# Altium project encoder-circuit.PrjPcb
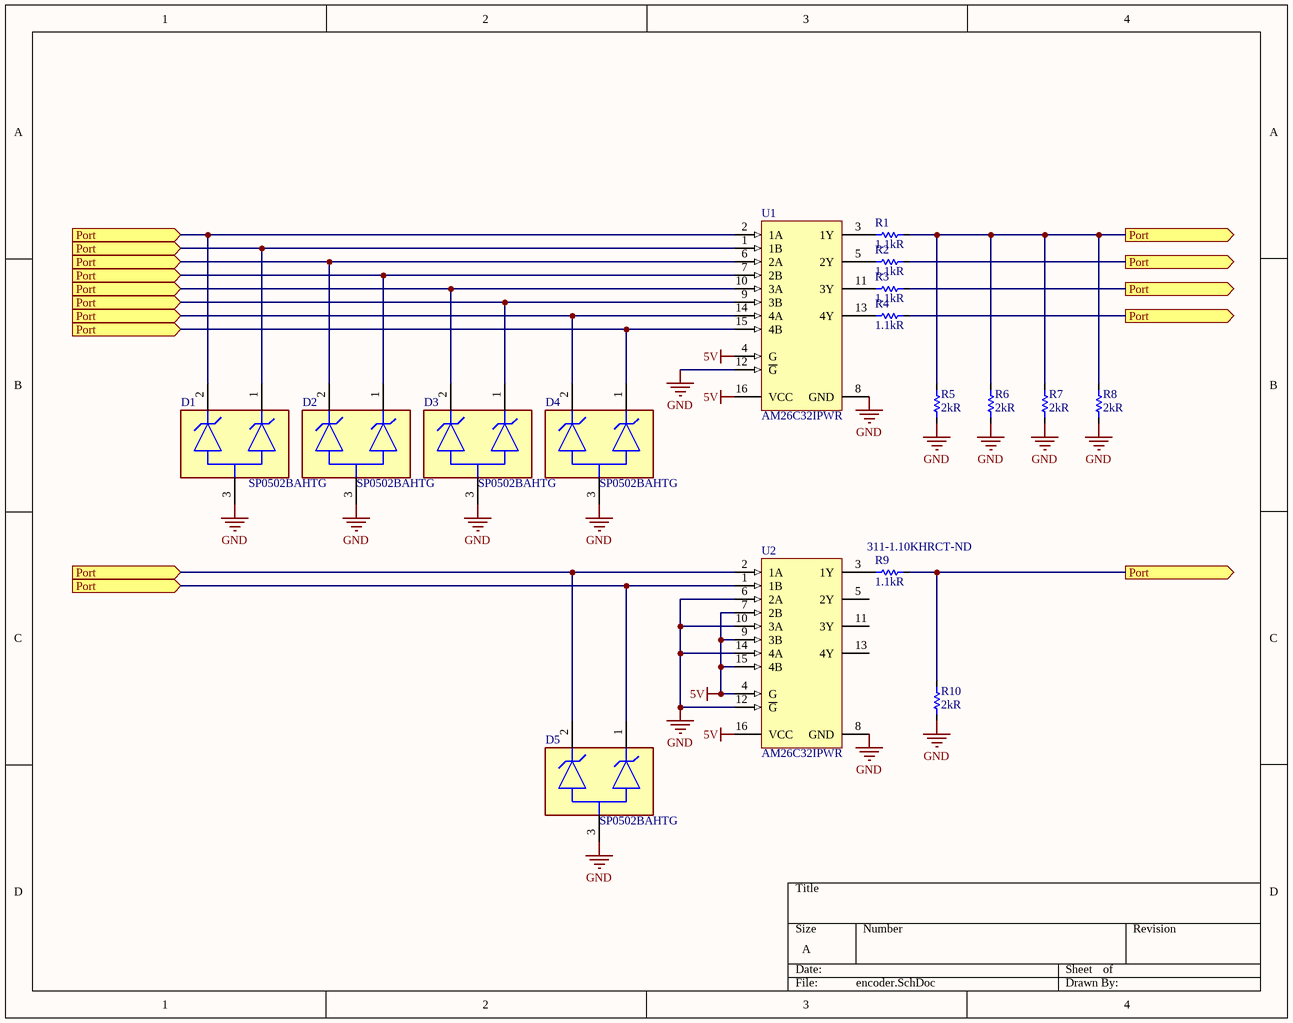
[diagram p0: encoder.SchDoc]
1 sheet, 17 parts. Net scope: flat (ports and power ports of the same name join across sheets).
Board file: encoder.PcbDoc

## Sheet encoder.SchDoc
size A

### Parts
D1  SP0502BAHTG  [FP-SP0502BAH-MFG]
D2  SP0502BAHTG  [FP-SP0502BAH-MFG]
D3  SP0502BAHTG  [FP-SP0502BAH-MFG]
D4  SP0502BAHTG  [FP-SP0502BAH-MFG]
D5  SP0502BAHTG  [FP-SP0502BAH-MFG]
R1  1.1kR  [RESC1005N]
R2  1.1kR  [RESC1005N]
R3  1.1kR  [RESC1005N]
R4  1.1kR  [RESC1005N]
R5  2kR  [RESC1005N]
R6  2kR  [RESC1005N]
R7  2kR  [RESC1005N]
R8  2kR  [RESC1005N]
R9  1.1kR  Supplier Part Number 1: 311-1.10KHRCT-ND  [RESC1005N]
R10  2kR  [RESC1005N]
U1  AM26C32IPWR  [PW0016A_L]
U2  AM26C32IPWR  [PW0016A_L]

### Ports
Port (in), Port (out)

### Nets
5V: U1.4(G) U1.16(VCC) U2.4(G) U2.7(2B) U2.9(3B) U2.15(4B) U2.16(VCC)
GND: D1.3(COMMON_ANODE) D2.3(COMMON_ANODE) D3.3(COMMON_ANODE) D4.3(COMMON_ANODE) D5.3(COMMON_ANODE) R5.2 R6.2 R7.2 R8.2 R10.2 U1.8(GND) U1.12(~{G}) U2.6(2A) U2.8(GND) U2.10(3A) U2.12(~{G}) U2.14(4A)
NetD1_1: D1.1(1_CATHODE) D1.2(2_CATHODE) D2.1(1_CATHODE) D2.2(2_CATHODE) D3.1(1_CATHODE) D3.2(2_CATHODE) D4.1(1_CATHODE) D4.2(2_CATHODE) D5.1(1_CATHODE) D5.2(2_CATHODE) R1.2 R2.2 R3.2 R4.2 R5.1 R6.1 R7.1 R8.1 R9.2 R10.1 U1.1(1B) U1.2(1A) U1.6(2A) U1.7(2B) U1.9(3B) U1.10(3A) U1.14(4A) U1.15(4B) U2.1(1B) U2.2(1A) ; port Port
NetR1_1: R1.1 U1.3(1Y)
NetR2_1: R2.1 U1.5(2Y)
NetR3_1: R3.1 U1.11(3Y)
NetR4_1: R4.1 U1.13(4Y)
NetR9_1: R9.1 U2.3(1Y)

Not connected (* = marked no-connect by the designer): U2 5(2Y) 11(3Y) 13(4Y)

### Library data of the parts
D1-D5 = CMP-08607-000028-1: TVS DIODE 5.5V 8.5V SOT23-3; Manufacturer: Littelfuse Inc; Description: 8.5V Clamp Ipp Tvs Diode Surface Mount SOT-23-3; Value: 30pF; Standoff Height: 0.01mm; Number Of Channels: 2; Direction: Unidirectional; Lead Free: Yes; Device Class L1: Circuit Protection; Temperature Range High: +125°C; Package: SP0502BAH; Reverse Standoff Voltage: 5.5V; Device Class L3: unset; Clamping Voltage: 8.5V; RoHS: TRUE; Capacitance: 30pF; Octopart: https://octopart.com/sp0502bahtg-littelfuse-66370; Temperature: -40°C to +125°C; Category: Diode; Manufacturer Part Number: SP0502BAHTG; ComponentLink2URL: https://www.littelfuse.com/~/media/electronics/datasheets/tvs_diode_arrays/littelfuse_tvs_diode_array_sp05_datasheet.pdf.pdf; Digikey Description: TVS DIODE 5.5V 8.5V SOT23-3; Mouser Description: TVS Diodes / ESD Suppressors 2 Channel SMT array; Height: 1.12mm; Automotive: No; Temperature Range Low: -40°C; Device Class L2: TVS Diodes; ComponentLink2Description: Datasheet
R1-R4 R9 = Resistor: RES SMD 1.1K OHM 1% 1/10W 0603; Manufacturer: Yageo; Manufacturer Part Number: RC0603FR-071K1L; Power Rating: 100mW; Temperature Coefficient: 100ppm/°C; Voltage Rating (DC): 50V; ComponentLink1URL: https://www.seielect.com/catalog/SEI-Packaging.pdf?src-supplier=Verical; ComponentLink1Description: https://www.seielect.com/catalog/SEI-Packaging.pdf?src-supplier=Verical; ComponentLink2URL: https://www.seielect.com/catalog/sei-rmcf_rmcp.pdf?src-supplier=Digi-Key; ComponentLink2Description: https://www.seielect.com/catalog/sei-rmcf_rmcp.pdf?src-supplier=Digi-Key; ComponentLink3URL: https://www.seielect.com/catalog/SEI-Packaging.pdf?src-supplier=Avnet; ComponentLink3Description: https://www.seielect.com/catalog/SEI-Packaging.pdf?src-supplier=Avnet; ComponentLink4URL: https://www.seielect.com/catalog/SEI-RMCF_RMCP.pdf?src-supplier=Avnet+Asia; ComponentLink4Description: https://www.seielect.com/catalog/SEI-RMCF_RMCP.pdf?src-supplier=Avnet+Asia; ComponentLink5URL: https://www.seielect.com/catalog/SEI-RMCF_RMCP.pdf?src-supplier=Avnet; ComponentLink5Description: https://www.seielect.com/catalog/SEI-RMCF_RMCP.pdf?src-supplier=Avnet; ComponentLink6URL: http://www.seielect.com/Catalog/SEI-rmc.pdf?src-supplier=Future+Electronics; ComponentLink6Description: http://www.seielect.com/Catalog/SEI-rmc.pdf?src-supplier=Future+Electronics; ComponentLink7URL: https://www.seielect.com/catalog/SEI-Packaging.pdf?src-supplier=Arrow+Electronics; ComponentLink7Description: https://www.seielect.com/catalog/SEI-Packaging.pdf?src-supplier=Arrow+Electronics; ComponentLink8URL: https://www.seielect.com/catalog/SEI-Packaging.pdf?src-supplier=Quest; ComponentLink8Description: https://www.seielect.com/catalog/SEI-Packaging.pdf?src-supplier=Quest; Supplier 1: Digi-Key; RoHS: Yes; Category: Chip SMD Resistors; Stock 1: 674535; Pricing 1: 1=0.10000, 10=0.02100, 100=0.00850, 1000=0.00382, 2500=0.00331 (USD); Case/Package: 0603; Number of Pins: 2; Case Code (Metric): 1608; Case Code (Imperial): 0603; Min Operating Temperature: -55°C; Max Operating Temperature: 155°C; Tolerance: 1%; Package Quantity: 1; Resistance: 1.1kR; Packaging: Tape and Reel; Voltage Rating: 50V; Resistor Type: Thick Film; Number of Terminations: 2; Termination: SMD/SMT; Max Power Dissipation: 100mW; Features: Moisture Resistant; Length: 1.6mm; Width: 0.031inch; Height: 0.022inch; Depth: 0.8mm; Lead Free: Lead Free; Military Standard: Not; REACH SVHC: No SVHC; ComponentLink9URL: https://datasheet.ciiva.com/2454/pyu-r-int-thick-7-2454112.pdf?src-supplier=Digi-Key; ComponentLink9Description: https://datasheet.ciiva.com/2454/pyu-r-int-thick-7-2454112.pdf?src-supplier=Digi-Key; ComponentLink10URL: https://datasheet.ciiva.com/2454/pyu-r-int-thick-7-2454113.pdf?src-supplier=Digi-Key; ComponentLink10Description: https://datasheet.ciiva.com/2454/pyu-r-int-thick-7-2454113.pdf?src-supplier=Digi-Key; ComponentLink11URL: https://datasheet.ciiva.com/2454/pyu-r-int-thick-7-2454111.pdf?src-supplier=Digi-Key; ComponentLink11Description: https://datasheet.ciiva.com/2454/pyu-r-int-thick-7-2454111.pdf?src-supplier=Digi-Key
  R1-R4: Supplier Part Number 1: 311-1.10KHRCT-ND
R5-R8 R10 = Resistor: YAGEO - RC0603FR-072KL - RES, THICK FILM, 2K, 1%, 0.1W, 0603; Temperature Coefficient: 100ppm/°C; Voltage Rating (DC): 50V; Power Rating: 100mW; Working Voltage: 75V; ComponentLink1URL: https://datasheet.ciiva.com/15193/getdatasheetpartid-362041-15193463.pdf?src-supplier=Verical; ComponentLink1Description: https://datasheet.ciiva.com/15193/getdatasheetpartid-362041-15193463.pdf?src-supplier=Verical; Supplier 1: Digi-Key; Supplier Part Number 1: 311-2.00KHRCT-ND; Manufacturer: Yageo; Manufacturer Part Number: RC0603FR-072KL; RoHS: Yes; Category: Chip SMD Resistors; Stock 1: 3184564; Pricing 1: 1=0.10000, 10=0.02100, 100=0.00850, 1000=0.00382, 2500=0.00331 (USD); Case/Package: 0603; Number of Pins: 2; Case Code (Metric): 1608; Case Code (Imperial): 0603; Min Operating Temperature: -55°C; Max Operating Temperature: 155°C; Resistance: 2kR; Tolerance: 1%; Resistor Type: Thick Film; Packaging: Tape and Reel; Voltage Rating: 50V; Package Quantity: 1; Number of Terminations: 2; Termination: SMD/SMT; Max Power Dissipation: 100mW; Features: Moisture Resistant; Length: 1.6mm; Width: 0.031inch; Height: 0.45mm; Depth: 0.8mm; Lead Free: Lead Free; REACH SVHC: No SVHC; Military Standard: Not; ComponentLink2URL: https://datasheet.ciiva.com/11808/0900766b80f96399-11808134.pdf?src-supplier=RSComponents; ComponentLink2Description: https://datasheet.ciiva.com/11808/0900766b80f96399-11808134.pdf?src-supplier=RSComponents; ComponentLink3URL: https://datasheet.ciiva.com/22747/443971-22747526.pdf?src-supplier=Element14; ComponentLink3Description: https://datasheet.ciiva.com/22747/443971-22747526.pdf?src-supplier=Element14; ComponentLink4URL: https://datasheet.ciiva.com/2453/pyu-r-int-thick-7-2453913.pdf?src-supplier=Digi-Key; ComponentLink4Description: https://datasheet.ciiva.com/2453/pyu-r-int-thick-7-2453913.pdf?src-supplier=Digi-Key; ComponentLink5URL: https://datasheet.ciiva.com/12555/rc0603-272842-12555257.pdf?src-supplier=Mouser; ComponentLink5Description: https://datasheet.ciiva.com/12555/rc0603-272842-12555257.pdf?src-supplier=Mouser; ComponentLink6URL: https://datasheet.ciiva.com/2453/pyu-r-int-thick-7-2453914.pdf?src-supplier=Digi-Key; ComponentLink6Description: https://datasheet.ciiva.com/2453/pyu-r-int-thick-7-2453914.pdf?src-supplier=Digi-Key; ComponentLink7URL: https://datasheet.ciiva.com/2453/pyu-r-int-thick-7-2453915.pdf?src-supplier=Digi-Key; ComponentLink7Description: https://datasheet.ciiva.com/2453/pyu-r-int-thick-7-2453915.pdf?src-supplier=Digi-Key
U1 U2 = CMP-0310-00522-2: Quadruple Differential Line Receiver, 0 TX / 4 RX, 5V, -40 to 85 degC, 16-Pin TSSOP (PW), Green (RoHS & no Sb/Br); Manufacturer: Texas Instruments; ESD(kV): 2; Receivers Per Package: 4; ICC(Max)(mA): 15; SubFamily: RS-422; Rating: Catalog; Supply Voltage(s)(V): 5; Description: IC RCVR RS422 QUAD DIFF 16TSSOP; Data Rate: 10Mbps; Nominal Supply Current: 15mA; Min Supply Voltage: 4.5V; Max Supply Voltage: 5.5V; PartNumber: AM26C32IPWR; Mounting Technology: Surface Mount; Code_JEDEC: MO-153; PackageVersion: revG, Feb-2011; DatasheetVersion: SLLS104I; Footprint: AM26LS32; ComponentLink1Description: Datasheet; ComponentLink2URL: http://www.ti.com/lit/ml/mpds361/mpds361.pdf; # of TX/RX: 0 TX / 4 RX; ComponentLink2Description: Package Specification; PackageReference: PW0016A; Eco-Plan: Green (RoHS & no Sb/Br); PackageDescription: 16-Pin Plastic Thin Small Outline Package 5 x 4.4 mm Body ,0.65 mm Pitch; ComponentLink1URL: http://www.ti.com/general/docs/lit/getliterature.tsp?genericPartNumber=AM26C32&fileType=pdf; Supplier 1: Digi-Key; Supplier Part Number 1: 296-30088-1-ND; Manufacturer Part Number: AM26C32IPWR; RoHS: Yes; Category: RS-232 / RS-422 / RS-485 Interface ICs; Stock 1: 5229; Pricing 1: 1=1.32000, 10=1.17700, 25=1.11720, 100=0.85790, 250=0.75812, 500=0.71820, 1000=0.55860 (USD); Case/Package: TSSOP; Number of Pins: 16; Weight: 0.002183oz; Contact Plating: Gold; Min Operating Temperature: -40°C; Max Operating Temperature: 125°C; Package Quantity: 1; Packaging: Tape and Reel; Number of Receivers: 4; Operating Supply Voltage: 5V; Logic Function: Receiver; Max Supply Current: 15mA; ESD Protection: No; Lead Free: Lead Free; ComponentLink3URL: https://datasheet.ciiva.com/1770/am26c32-1770055.pdf?src-supplier=Digi-Key; ComponentLink3Description: https://datasheet.ciiva.com/1770/am26c32-1770055.pdf?src-supplier=Digi-Key; ComponentLink4URL: https://datasheet.ciiva.com/1770/am26c32-1770056.pdf?src-supplier=Digi-Key; ComponentLink4Description: https://datasheet.ciiva.com/1770/am26c32-1770056.pdf?src-supplier=Digi-Key; ComponentLink5URL: https://datasheet.ciiva.com/1770/am26c32-1770057.pdf?src-supplier=Digi-Key; ComponentLink5Description: https://datasheet.ciiva.com/1770/am26c32-1770057.pdf?src-supplier=Digi-Key; ComponentLink6URL: https://datasheet.ciiva.com/48709/001047716-da-01-en-ic-4x-dff-ln-rc-am26c32ipwr-tssop-16-tid-48709253.pdf?src-supplier=Conrad; ComponentLink6Description: https://datasheet.ciiva.com/48709/001047716-da-01-en-ic-4x-dff-ln-rc-am26c32ipwr-tssop-16-tid-48709253.pdf?src-supplier=Conrad